# Altium schematic sheet DAC.SchDoc
size A4; Organization: Rotronic AG; Address1: Grindelstrasse 6; Address2: 8303 Bassersdorf; Address3: Switzerland; DocumentNumber: 8; SheetNumber: 8; SheetTotal: 10; Web_Address: www.rotronic.ch; E_Mail_Address: *@rotronic.ch; Fon: +41 (0)44 838 11 11; Fax: +41 (0)44 836 44 24
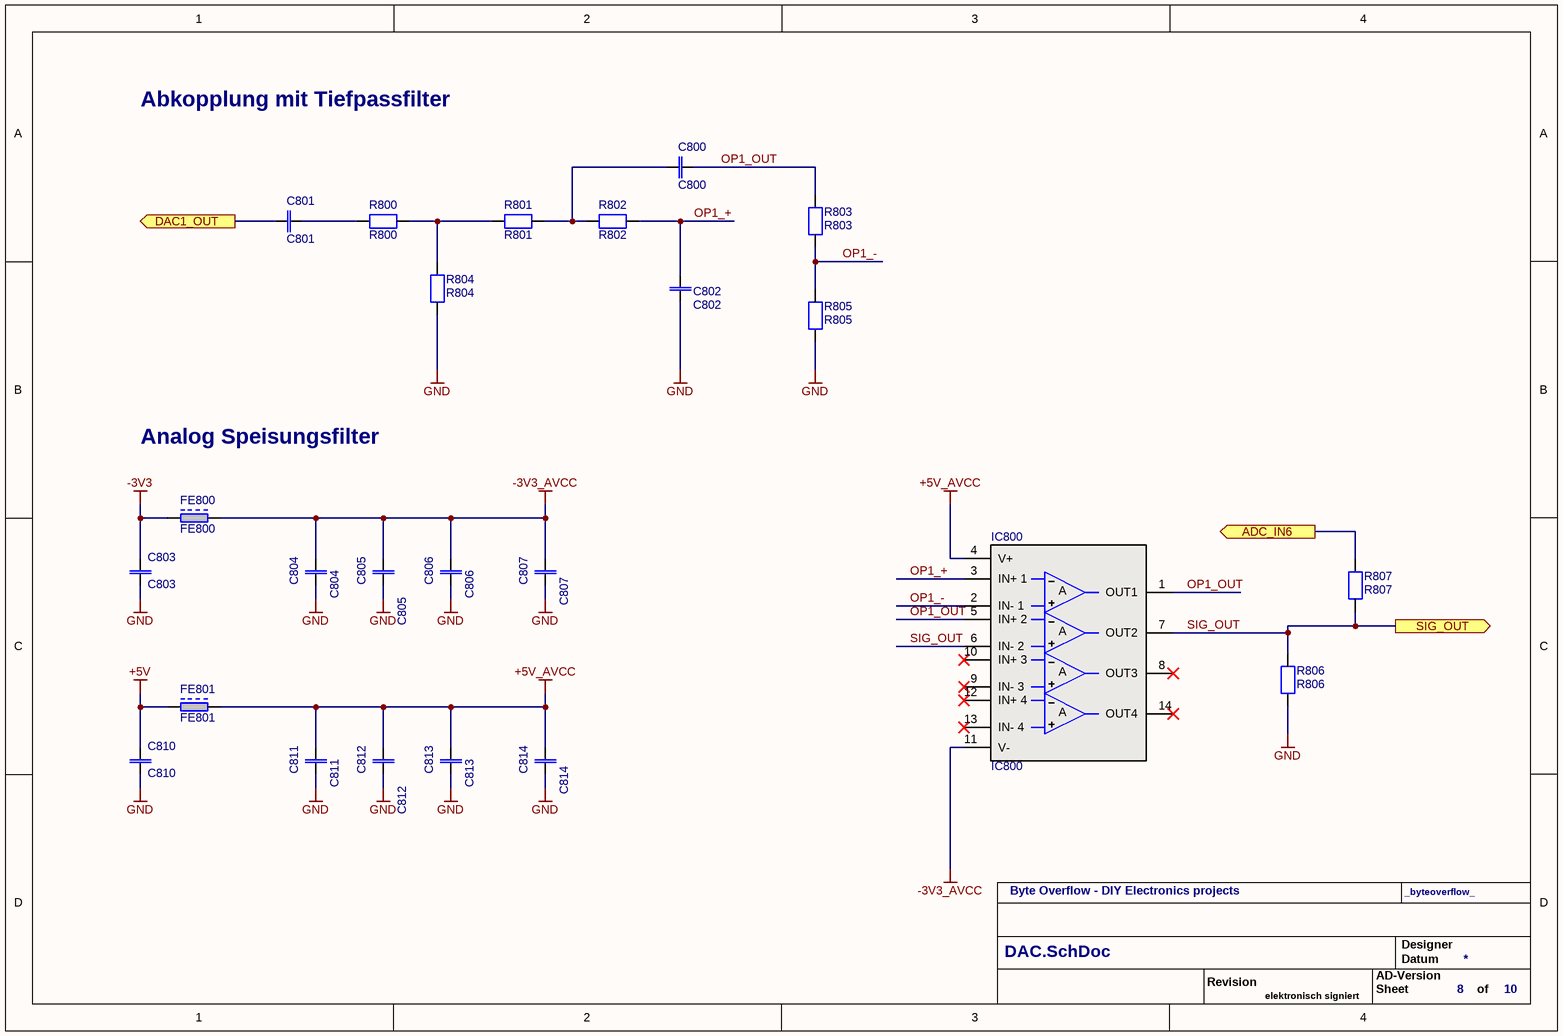
[diagram p0: DAC.SchDoc]

## Parts
C800  C800  [0603-1608]
C801  C801  [0805-2012]
C802  C802  [0603-1608]
C803  C803  [0402-1005]
C804  C804  [0805-2012]
C805  C805  [0603-1608]
C806  C806  [0805-2012]
C807  C807  [0603-1608]
C810  C810  [0402-1005]
C811  C811  [0805-2012]
C812  C812  [0603-1608]
C813  C813  [0805-2012]
C814  C814  [0603-1608]
FE800  FE800  [0603-1608]
FE801  FE801  [0603-1608]
IC800  IC800  [SOIC-14]
R800  R800  [0603-1608]
R801  R801  [0603-1608]
R802  R802  [0603-1608]
R803  R803  [0603-1608]
R804  R804  [0603-1608]
R805  R805  [0603-1608]
R806  R806  [0603-1608]
R807  R807  [0603-1608]

## Ports
ADC_IN6 (out), DAC1_OUT (out), SIG_OUT (out)

## Nets
+5V: C810.1 FE801.2
+5V_AVCC: C811.1 C812.1 C813.1 C814.1 FE801.1 IC800.4(V+)
-3V3: C803.1 FE800.2
-3V3_AVCC: C804.1 C805.1 C806.1 C807.1 FE800.1 IC800.11(V-)
GND: C802.1 C803.2 C804.2 C805.2 C806.2 C807.2 C810.2 C811.2 C812.2 C813.2 C814.2 R804.2 R805.1 R806.1
ADC_IN6: R807.1 ; port ADC_IN6
DAC1_OUT: C801.1 ; port DAC1_OUT
OP1_+: C802.2 IC800.3(IN+_1) R802.2
OP1_-: IC800.2(IN-_1) R803.2 R805.2
OP1_OUT: C800.2 IC800.1(OUT1) IC800.5(IN+_2) R803.1
SIG_OUT: IC800.6(IN-_2) IC800.7(OUT2) R806.2 R807.2 ; port SIG_OUT
NetC800_1: C800.1 R801.2 R802.1
NetC801_2: C801.2 R800.1
NetR800_2: R800.2 R801.1 R804.1

Not connected (* = marked no-connect by the designer): IC800 8(OUT3)* 9(IN-_3)* 10(IN+_3)* 12(IN+_4)* 13(IN-_4)* 14(OUT4)*

## Notes on the sheet
- Abkopplung mit Tiefpassfilter
- Analog Speisungsfilter
- Byte Overflow - DIY Electronics projects
- _byteoverflow_
- Revision
- AD-Version
- Designer
- Datum
- elektronisch signiert
- Sheet
- of
- (in symbol I0016) A

## Library data of the parts
C800 C802 = F0058: Capacitor; Part-Number: 63.0224.1400; Manufacturer: KEMET; Manufacturer Part Number: C0603C224K4RAC7867; Designator: C 220nF 16V; ID: F0058; Operating Range: -55°C to +85°C; Note: 220nF X5R 16V 10% Taiyo Yuden EMK107BJ224KAHT; Specification: 19.09.2011 MLP; Verification: 05.07.2012 OPT; Value: 220nF 16V; Component Type: Standard; ComponentLink1Description: http://www.kemet.com/docfinder?Partnumber=C0603C224K4RACTU; ComponentLink1URL: http://www.kemet.com/docfinder?Partnumber=C0603C224K4RACTU; Status: Active; Availability Date: 15.11.2016 OPT; RoHS compliant: Yes; Flammability: n.a.; Pin Count: 2; Price 100: 0.02; Price 1000: 0.02; Price Date: 02.12.2019 Pro Alpha; Changed: 19.09.2011 MLP; Price: 0.02; Supplier 1: Digi-Key; Supplier Part Number 1: 399-5619-1-ND; Part Status: Active; RoHS: RoHS Compliant
C801 C804 C806 C811 C813 = F0127: Capacitor; Part-Number: 63.0105.1500; Manufacturer: Murata Electronics North America; Manufacturer Part Number: GRM21BF51H105ZA12L; ID: F0127; Operating Range: -30°C to +85°C; Note: 1uF 50V Y5V 20% Murata GRM21BF51H105ZA12L; Specification: 27.12.2012 OPT; Value: 1uF 50V; Designator: C 1uF 50V; Component Type: Standard; Status: Active; Availability Date: 15.11.2016 OPT; RoHS compliant: Yes; Flammability: n.a.; Pin Count: 2; Price 100: 0.067; Price 1000: 0.067; Price Date: 02.12.2019 Pro Alpha; Changed: 27.12.2012 OPT; Price: 0.118; Supplier 1: Digi-Key; Supplier Part Number 1: 490-3903-1-ND; Part Status: Discontinued at Digi-Key; RoHS: RoHS Compliant; ComponentLink1Description: Datasheet; ComponentLink1URL: http://www.murata.com/products/catalog/pdf/c02e.pdf; ComponentLink2Description: http://search.murata.co.jp/Ceramy/image/img/A01X/G101/ENG/GRM21BF51H105ZA12-01.pdf; ComponentLink2URL: http://search.murata.co.jp/Ceramy/image/img/A01X/G101/ENG/GRM21BF51H105ZA12-01.pdf
C803 C810 = F0092: Capacitor; Part-Number: 63.7000.0030; Manufacturer: Taiyo Yuden; Manufacturer Part Number: JMK105BBJ475MV-F; Designator: C 4.7uF 6.3V; ID: F0092; Operating Range: -55°C to +85°C; Note: 4.7uF X5R 6.3V 20% Taiyo Yuden JMK105BBJ475MV-F; Specification: 19.09.2011 MLP; Verification: 05.07.2012 OPT; Value: 4.7uF 6.3V; Component Type: Standard; ComponentLink1Description: http://ds.yuden.co.jp/TYCOMPAS/ut/detail.do?productNo=JMK105BBJ475MV-F&fileName=JMK105BBJ475MV-F_SS&mode=specSheetDownload; ComponentLink1URL: http://ds.yuden.co.jp/TYCOMPAS/ut/detail.do?productNo=JMK105BBJ475MV-F&fileName=JMK105BBJ475MV-F_SS&mode=specSheetDownload; Status: Active; Availability Date: 15.11.2016 OPT; RoHS compliant: Yes; Flammability: n.a.; Pin Count: 2; Price 100: 0.057; Price 1000: 0.057; Price Date: 02.12.2019 Pro Alpha; Changed: 19.09.2011 MLP; Price: 0.012; Supplier Part Number 1: 587-2787-1-ND; Part Status: Active; RoHS: RoHS Compliant; Supplier 1: Digi-Key
C805 C807 C812 C814 = F0161: Capacitor; Part-Number: 63.0104.1450; Manufacturer: KEMET; Manufacturer Part Number: C0603C104K5RACTU; ID: F0161; Operating Range: -55°C to +125°C; Note: 100nF 50V X7R 10% Kemet C0603C104K5RACTU; Specification: 05.09.2013 OPT; Value: 100nF 50V; Designator: C 100nF 50V X7R; Component Type: Standard; ComponentLink1Description: Datasheet; ComponentLink1URL: http://www.kemet.com/kemet/web/homepage/kechome.nsf/vapubfiles/KEM_C1002_X7R_SMD.pdf/$file/KEM_C1002_X7R_SMD.pdf; Pin Count: 2; Price 100: 0.007; Price 1000: 0.007; Price Date: 02.12.2019 Pro Alpha; Changed: 05.09.2013 OPT; Price: 0.01; Availability Date: 15.11.2016 OPT; Flammability: n.a.; RoHS compliant: Yes; Status: Active; Part Status: Active; RoHS: RoHS Compliant; Supplier Part Number 1: 399-5089-1-ND; Supplier 1: Digi-Key
FE800 FE801 = M0071: Ferrite; Part-Number: 69.1810.2000; Manufacturer: Murata Electronics North America; ID: M0071; Operating Range: -55°C to +125°C; Note: Murata BLM18AG102SN1D Ferrit 1000Ohm 400mA; Specification: 21.09.2016 OPT; Value: BLM18AG102SN1D; Component Type: Standard; Pin Count: 2; Price Date: 02.12.2019 Pro Alpha; Changed: 21.09.2016 OPT; Price: 0.021; ComponentLink1Description: Datasheet; ComponentLink1URL: http://search.murata.co.jp/Ceramy/image/img/PDF/ENG/L0110S0100BLM18A.pdf; Price 100: 0.035; Price 1000: 0.026; Availability Date: 21.09.2016 OPT; Flammability: n.a.; RoHS compliant: Yes; Status: Active; Manufacturer Part Number: BLM18AG102SN1D; Part Status: Active; RoHS: RoHS Compliant; Supplier Part Number 1: 490-1015-1-ND; Supplier 1: Digi-Key; Designator: BLM18AG102SN1D
IC800 = I0016: OPAMP; Part-Number: 00.0000.0000; Manufacturer: Texas Instruments; Designator: LMC6484IMX/NOPB; ID: I0016; Operating Range: -40°C to +125°C; Note: Operationsverstärker CMOS QUAD Rail to Rail; Changed: 19.09.2020 PEK; Value: LMC6484IMX/NOPB; Component Type: Standard; ComponentLink1Description: Datasheet; ComponentLink1URL: https://www.ti.com/lit/ds/symlink/lmc6484.pdf?ts=1600470487572&ref_url=https%253A%252F%252Fwww.ti.com%252Fstore%252Fti%252Fen%252Fp%252Fproduct%252F%253Fp%253DLMC6484IMX%252FNOPB; Status: Active; Availability Date: 19.09.2020 PEK; RoHS compliant: Yes; Flammability: n.a.; Pin Count: 14; Price 100: 1.52; Price 1000: 1.03; Price Date: 19.09.2020 PEK; Specification: 19.09.2020 PEK; Price: 2.25; Supplier 1: Mouser; Supplier Part Number 1: LMC6484IMX/NOPB; Manufacturer Part Number: LMC6484IMX/NOPB; Part Status: Active; RoHS: RoHS Compliant
R800 = Q0174: Resistor; Part-Number: 71.5602.1300; Manufacturer: Vishay Dale; Manufacturer Part Number: CRCW060356K0FKEA; Designator: R 56k 1%; ID: Q0174; Note: 56k 1% 100ppm 1/10W Vishay CRCW060356K0FKEA; Changed: 19.09.2011 MLP; Verification: 05.07.2012 OPT; Value: 56k 1%; Component Type: Standard; ComponentLink1Description: http://www.vishay.com/docs/20035/dcrcwe3.pdf; ComponentLink1URL: http://www.vishay.com/docs/20035/dcrcwe3.pdf; Operating Range: -; Status: Active; Availability Date: 16.11.2016 OPT; RoHS compliant: Yes; Flammability: n.a.; Pin Count: 2; Price 100: 0.002; Price 1000: 0.002; Price Date: 02.12.2019 Pro Alpha; Specification: 19.09.2011 MLP; Price: 0.002; Supplier: Digi-Key; Supplier Part Number: 541-56.0KHCT-ND; Part Status: Active; RoHS: RoHS Compliant
R801 R802 R805-R807 = Q0017: Resistor; Part-Number: 71.1002.1300; Manufacturer: Vishay Dale; Manufacturer Part Number: CRCW060310K0FKEAHP; Designator: R 10k 1%; ID: Q0017; Operating Range: -55°C to +155°C; Note: 10k 1% 100ppm 1/10W Vishay CRCW060310K0FKEA; Changed: 19.09.2011 MLP; Verification: 05.07.2012 OPT; Value: 10k; Component Type: Standard; ComponentLink1Description: http://www.vishay.com/docs/20043/crcwhpe3.pdf; ComponentLink1URL: http://www.vishay.com/docs/20043/crcwhpe3.pdf; Status: Active; Availability Date: 16.11.2016 OPT; RoHS compliant: Yes; Flammability: n.a.; Pin Count: 2; Price 100: 0.002; Price 1000: 0.002; Price Date: 02.12.2019 Pro Alpha; Specification: 19.09.2011 MLP; Price: 0.001; Supplier: Digi-Key; Supplier Part Number: 541-10.0KSCT-ND; Part Status: Active; RoHS: RoHS Compliant
R803 = Q0180: Resistor; Part-Number: 71.6801.1300; Manufacturer: Vishay Dale; Manufacturer Part Number: CRCW06036K80FKEA; Designator: R 6.8k 1%; ID: Q0180; Operating Range: -55°C to +155°C; Note: 6.8k 1% 100ppm 1/10W Vishay CRCW06036K80FKEA; Changed: 19.09.2011 MLP; Verification: 05.07.2012 OPT; Value: 6.8k 1%; Component Type: Standard; ComponentLink1Description: http://www.vishay.com/docs/20035/dcrcwe3.pdf; ComponentLink1URL: http://www.vishay.com/docs/20035/dcrcwe3.pdf; Status: Active; Availability Date: 16.11.2016 OPT; RoHS compliant: Yes; Flammability: n.a.; Pin Count: 2; Price 100: 0.002; Price 1000: 0.002; Price Date: 02.12.2019 Pro Alpha; Specification: 19.09.2011 MLP; Price: 0.002; Supplier: Digi-Key; Supplier Part Number: 541-6.80KHCT-ND; Part Status: Active; RoHS: RoHS Compliant
R804 = Q0073: Resistor; Part-Number: 71.1802.1300; Manufacturer: Vishay Dale; Manufacturer Part Number: CRCW060318K0FKEA; Designator: R 18k 1%; ID: Q0073; Operating Range: -55°C to +155°C; Note: 18k 1% 100ppm 1/10W Vishay CRCW060318K0FKTA; Changed: 19.09.2011 MLP; Verification: 05.07.2012 OPT; Value: 18k 1%; Component Type: Standard; ComponentLink1Description: http://www.vishay.com/docs/20035/dcrcwe3.pdf; ComponentLink1URL: http://www.vishay.com/docs/20035/dcrcwe3.pdf; Status: Active; Availability Date: 16.11.2016 OPT; RoHS compliant: Yes; Flammability: n.a.; Pin Count: 2; Price 100: 0.002; Price 1000: 0.002; Price Date: 02.12.2019 Pro Alpha; Specification: 19.09.2011 MLP; Price: 0.002; Supplier: Digi-Key; Supplier Part Number: 541-18.0KHDKR-ND; Part Status: Active; RoHS: RoHS Compliant